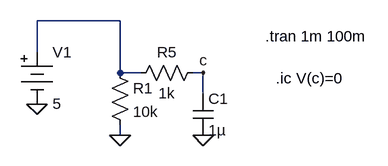
[diagram p0: schematic button.asc]
button.asc, the LTspice schematic file:
Version 4
SHEET 1 880 680
WIRE 256 176 128 176
WIRE 128 224 128 176
WIRE 256 256 256 176
WIRE 288 256 256 256
WIRE 384 256 368 256
WIRE 384 288 384 256
WIRE 256 352 256 336
FLAG 128 304 0
FLAG 256 352 0
FLAG 384 352 0
FLAG 384 256 c
SYMBOL Cap 368 288 R0
SYMATTR InstName C1
SYMATTR Value 1µ
SYMBOL Res 384 240 R90
WINDOW 0 0 56 VBottom 2
WINDOW 3 32 56 VTop 2
SYMATTR InstName R5
SYMATTR Value 1k
SYMBOL Misc/battery 128 208 R0
SYMATTR InstName V1
SYMATTR Value 5
SYMBOL Res 240 240 R0
SYMATTR InstName R1
SYMATTR Value 10k
TEXT 480 200 Left 2 !.tran 1m 100m
TEXT 496 264 Left 2 !.ic V(c)=0

The netlist it stands for:
* button.asc
C1 c 0 1µ
R5 c N001 1k
V1 N001 0 5
R1 N001 0 10k
.tran 1m 100m
.ic V(c)=0
.backanno
.end